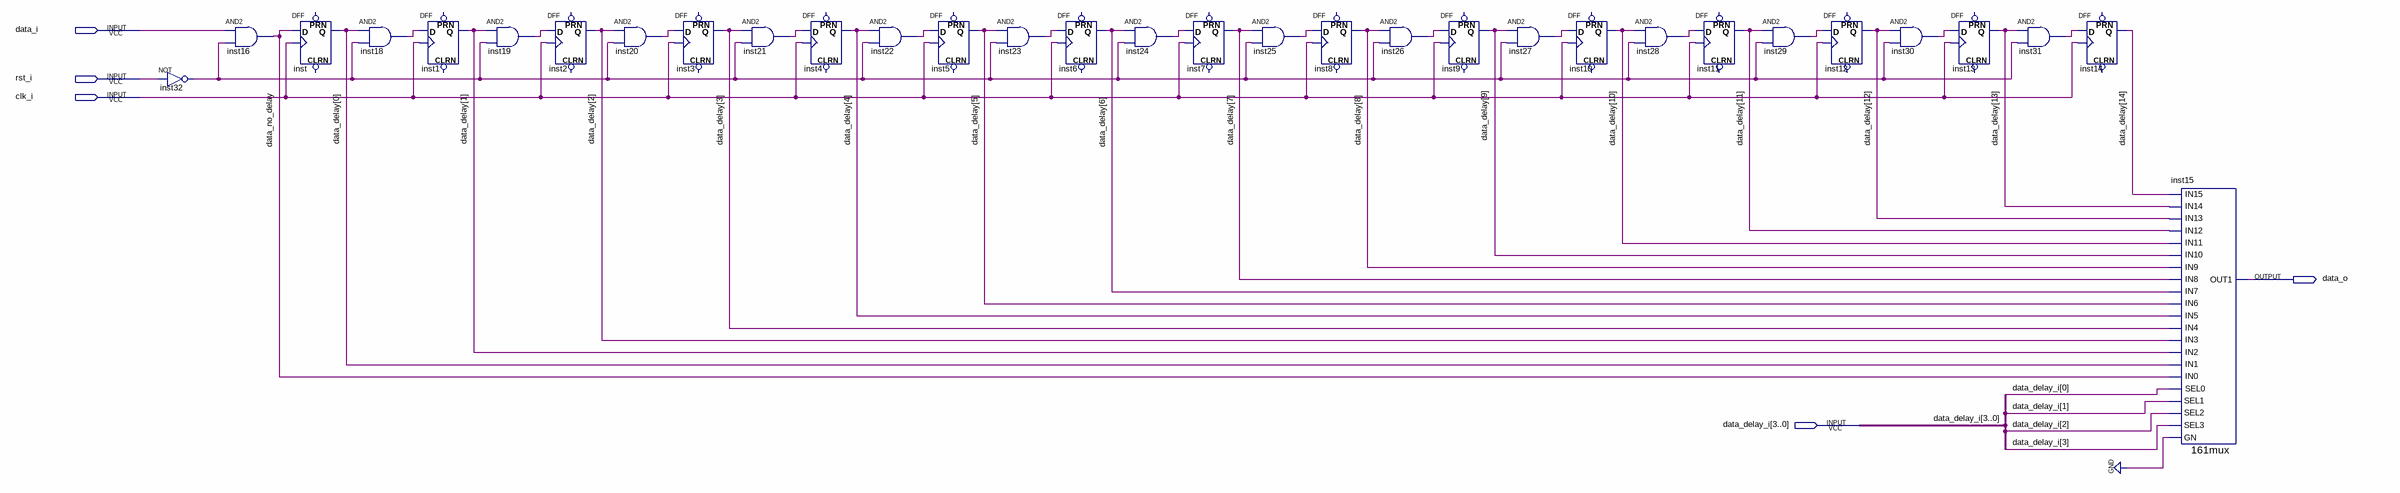
[diagram p0: schematic sheet]
// Quartus schematic delay_15.bdf as structural Verilog: 32 symbols, 5 pins
module delay_15 (
  input  data_i,
  input  rst_i,
  input  clk_i,
  input  [3:0] data_delay_i,
  output data_o
);

  wire data_no_delay, inst18_out, inst19_out, inst20_out, inst21_out, inst22_out, inst23_out, inst24_out,
       inst25_out, inst26_out, inst27_out, inst28_out, inst29_out, inst30_out, inst31_out, inst32_out;
  wire [14:0] data_delay;

  not inst32 (inst32_out, rst_i);
  and inst16 (data_no_delay, data_i, inst32_out);
  DFF inst (.CLK(clk_i), .D(data_no_delay), .Q(data_delay[0]));  // open: CLRN, PRN
  and inst18 (inst18_out, data_delay[0], inst32_out);
  DFF inst1 (.CLK(clk_i), .D(inst18_out), .Q(data_delay[1]));  // open: CLRN, PRN
  and inst19 (inst19_out, data_delay[1], inst32_out);
  DFF inst2 (.CLK(clk_i), .D(inst19_out), .Q(data_delay[2]));  // open: CLRN, PRN
  and inst20 (inst20_out, data_delay[2], inst32_out);
  DFF inst3 (.CLK(clk_i), .D(inst20_out), .Q(data_delay[3]));  // open: CLRN, PRN
  and inst21 (inst21_out, data_delay[3], inst32_out);
  DFF inst4 (.CLK(clk_i), .D(inst21_out), .Q(data_delay[4]));  // open: CLRN, PRN
  and inst22 (inst22_out, data_delay[4], inst32_out);
  DFF inst5 (.CLK(clk_i), .D(inst22_out), .Q(data_delay[5]));  // open: CLRN, PRN
  and inst23 (inst23_out, data_delay[5], inst32_out);
  DFF inst6 (.CLK(clk_i), .D(inst23_out), .Q(data_delay[6]));  // open: CLRN, PRN
  and inst24 (inst24_out, data_delay[6], inst32_out);
  DFF inst7 (.CLK(clk_i), .D(inst24_out), .Q(data_delay[7]));  // open: CLRN, PRN
  and inst25 (inst25_out, data_delay[7], inst32_out);
  DFF inst8 (.CLK(clk_i), .D(inst25_out), .Q(data_delay[8]));  // open: CLRN, PRN
  and inst26 (inst26_out, data_delay[8], inst32_out);
  DFF inst9 (.CLK(clk_i), .D(inst26_out), .Q(data_delay[9]));  // open: CLRN, PRN
  and inst27 (inst27_out, data_delay[9], inst32_out);
  DFF inst10 (.CLK(clk_i), .D(inst27_out), .Q(data_delay[10]));  // open: CLRN, PRN
  and inst28 (inst28_out, data_delay[10], inst32_out);
  DFF inst11 (.CLK(clk_i), .D(inst28_out), .Q(data_delay[11]));  // open: CLRN, PRN
  and inst29 (inst29_out, data_delay[11], inst32_out);
  DFF inst12 (.CLK(clk_i), .D(inst29_out), .Q(data_delay[12]));  // open: CLRN, PRN
  and inst30 (inst30_out, data_delay[12], inst32_out);
  DFF inst13 (.CLK(clk_i), .D(inst30_out), .Q(data_delay[13]));  // open: CLRN, PRN
  and inst31 (inst31_out, data_delay[13], inst32_out);
  DFF inst14 (.CLK(clk_i), .D(inst31_out), .Q(data_delay[14]));  // open: CLRN, PRN
  \161mux  inst15 (
    .SEL3(data_delay_i[3]), .GN(1'b0), .IN0(data_no_delay), .SEL0(data_delay_i[0]), .SEL1(data_delay_i[1]),
    .SEL2(data_delay_i[2]), .IN3(data_delay[2]), .IN2(data_delay[1]), .IN1(data_delay[0]),
    .IN6(data_delay[5]), .IN5(data_delay[4]), .IN4(data_delay[3]), .IN9(data_delay[8]), .IN8(data_delay[7]),
    .IN7(data_delay[6]), .IN11(data_delay[10]), .IN12(data_delay[11]), .IN10(data_delay[9]),
    .IN15(data_delay[14]), .IN14(data_delay[13]), .IN13(data_delay[12]), .OUT1(data_o));
endmodule
